# EAGLE schematic TeamB_PowerBoard (EAGLE 7.1.0)
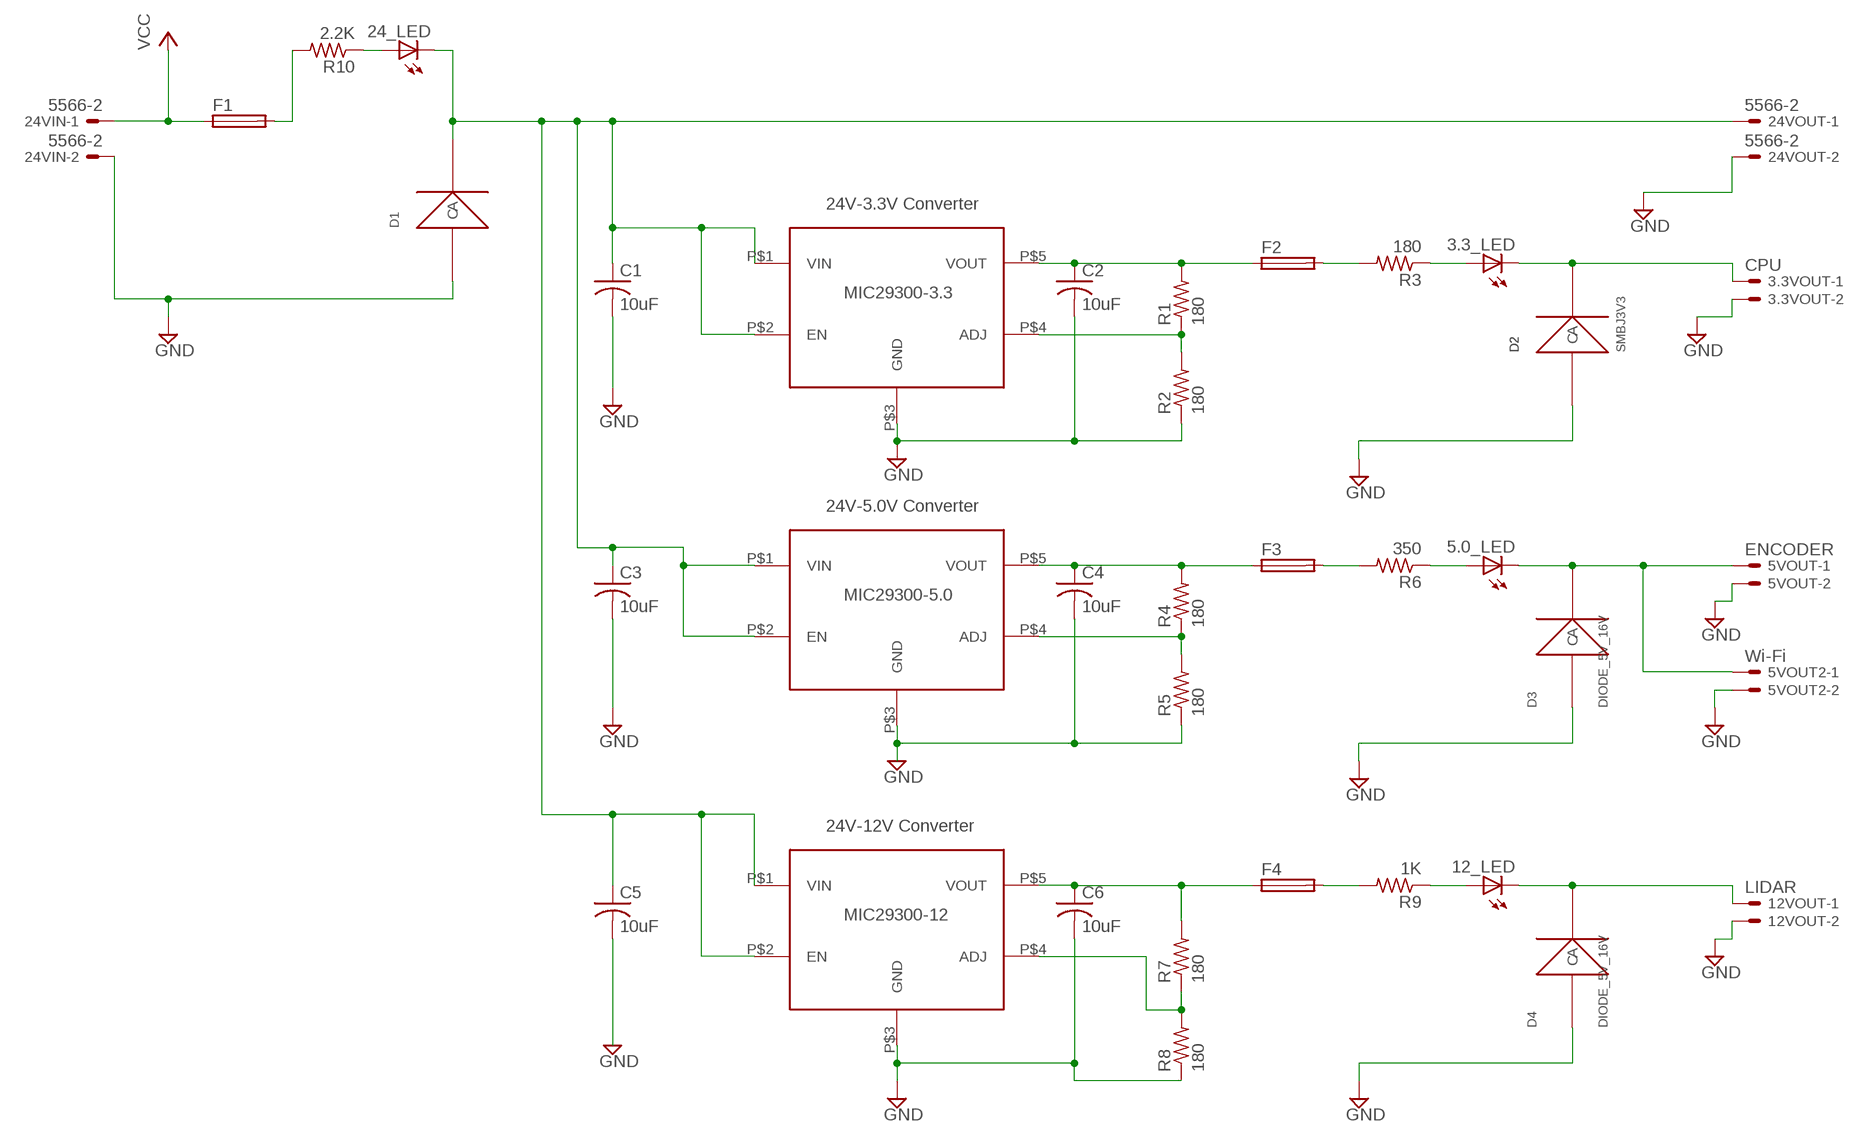
[diagram p0: schematic, sheet 1]

## Parts
3.3_LED  LEDSML1206  [SML1206]
3.3VOUT  CPU  C-GRID-02-70543  [70543-02]
5.0_LED  LEDSML1206  [SML1206]
5VOUT  ENCODER  C-GRID-02-70543  [70543-02]
5VOUT2  Wi-Fi  C-GRID-02-70543  [70543-02]
12_LED  LEDSML1206  [SML1206]
12VOUT  LIDAR  C-GRID-02-70543  [70543-02]
24_LED  LEDSML1206  [SML1206]
24VIN  5566-2  [5566-2]
24VOUT  5566-2  [5566-2]
C1  10uF  C-USC2220K  [C2220K]
C2  10uF  C-USC2220K  [C2220K]
C3  10uF  C-USC2220K  [C2220K]
C4  10uF  C-USC2220K  [C2220K]
C5  10uF  C-USC2220K  [C2220K]
C6  10uF  C-USC2220K  [C2220K]
D1  DIODE_26  [DIODE_26]
D2  SMBJ3V3  [SMBJ3V3]
D3  DIODE_5V_16V  [DIODE_5V_16V]
D4  DIODE_5V_16V  [DIODE_5V_16V]
F1  TE5  [TE5]
F2  TE5  [TE5]
F3  TE5  [TE5]
F4  TE5  [TE5]
R1  180  R-US_R1206  [R1206]
R2  180  R-US_R1206  [R1206]
R3  180  R-US_R1206  [R1206]
R4  180  R-US_R1206  [R1206]
R5  180  R-US_R1206  [R1206]
R6  350  R-US_R1206  [R1206]
R7  180  R-US_R1206  [R1206]
R8  180  R-US_R1206  [R1206]
R9  1K  R-US_R1206  [R1206]
R10  2.2K  R-US_R1206  [R1206]
U$1  MIC29300  [MIC29300W]
U$2  MIC29300  [MIC29300W]
U$3  MIC29300  [MIC29300W]

## Nets
GND: 3.3VOUT.2 5VOUT2.2 5VOUT.2 12VOUT.2 24VIN.2 24VOUT.2 C1.2 C2.2 C3.2 C6.2 D1.1(A) D2.1(A) D3.1(A) D4.1(A) R2.1 R8.1 U$1.P$3(GND) U$3.P$3(GND)
N$1: 24_LED.C 24VOUT.1 C1.1 C3.1 C5.1 D1.2(C) U$1.P$1(VIN) U$1.P$2(EN) U$2.P$1(VIN) U$2.P$2(EN) U$3.P$1(VIN) U$3.P$2(EN)
N$2: C5.2
N$3: F2.2 R3.2
N$4: 3.3_LED.A R3.1
N$5: C2.1 F2.1 R1.2 U$1.P$5(VOUT)
N$6: C4.2 R5.1 U$2.P$3(GND)
N$7: C4.1 F3.1 R4.2 U$2.P$5(VOUT)
N$8: C6.1 F4.1 R7.2 U$3.P$5(VOUT)
N$9: 3.3_LED.C 3.3VOUT.1 D2.2(C)
N$10: F1.2 R10.2
N$11: F3.2 R6.2
N$12: R1.1 R2.2 U$1.P$4(ADJ)
N$13: R4.1 R5.2 U$2.P$4(ADJ)
N$14: 5.0_LED.A R6.1
N$15: 5.0_LED.C 5VOUT2.1 5VOUT.1 D3.2(C)
N$16: F4.2 R9.2
N$17: 12_LED.A R9.1
N$18: 12_LED.C 12VOUT.1 D4.2(C)
N$19: R7.1 R8.2 U$3.P$4(ADJ)
N$20: 24_LED.A R10.1
VCC: 24VIN.1 F1.1

## Library data of the parts
3.3_LED 5.0_LED 12_LED 24_LED = led:LED: LED OSRAM: - CHIPLED LG R971, LG N971, LY N971, LG Q971, LY Q971, LO R971, LY R971 LH N974, LH R974 LS Q976, LO Q976, LY Q976 LO Q996 - Hyper CHIPLED LW Q18S LB Q993, LB Q99A, LB R99A - SideLED LS A670, LO A670, LY A670, LG A670, LP A670 LB A673, LV A673, LT A673, LW A673 LH A674 LY A675 LS A676, LA A676, LO A676, LY A676, LW A676 LS A679, LY A679, LG A679 - Hyper Micro SIDELED® LS Y876, LA Y876, LO Y876, LY Y876 LT Y87S - SmartLED LW L88C, LW L88S LB L89C, LB L89S, LG L890 LS L89K, LO L89K, LY L89K LS L896, LA L896, LO L896, LY L896 - TOPLED LS T670, LO T670, LY T670, LG T670, LP T670 LSG T670, LSP T670, LSY T670, LOP T670, LYG T670 LG T671, LOG T671, LSG T671 LB T673, LV T673, LT T673, LW T673 LH T674 LS T676, LA T676, LO T676, LY T676, LB T676, LH T676, LSB T676, LW T676 LB T67C, LV T67C, LT T67C, LS T67K, LO T67K, LY T67K, LW E67C LS E67B, LA E67B, LO E67B, LY E67B, LB E67C, LV E67C, LT E67C LW T67C LS T679, LY T679, LG T679 LS T770, LO T770, LY T770, LG T770, LP T770 LB T773, LV T773, LT T773, LW T773 LH T774 LS E675, LA E675, LY E675, LS T675 LS T776, LA T776, LO T776, LY T776, LB T776 LHGB T686 LT T68C, LB T68C - Hyper Mini TOPLED® LB M676 - Mini TOPLED Santana® LG M470 LS M47K, LO M47K, LY M47K Source: http://www.osram.convergy.de LUXEON: - LUMILED® LXK2-PW12-R00, LXK2-PW12-S00, LXK2-PW14-U00, LXK2-PW14-V00 LXK2-PM12-R00, LXK2-PM12-S00, LXK2-PM14-U00 LXK2-PE12-Q00, LXK2-PE12-R00, LXK2-PE12-S00, LXK2-PE14-T00, LXK2-PE14-U00 LXK2-PB12-K00, LXK2-PB12-L00, LXK2-PB12-M00, LXK2-PB14-N00, LXK2-PB14-P00, LXK2-PB14-Q00 LXK2-PR12-L00, LXK2-PR12-M00, LXK2-PR14-Q00, LXK2-PR14-R00 LXK2-PD12-Q00, LXK2-PD12-R00, LXK2-PD12-S00 LXK2-PH12-R00, LXK2-PH12-S00 LXK2-PL12-P00, LXK2-PL12-Q00, LXK2-PL12-R00 Source: www.luxeon.com KINGBRIGHT: KA-3528ASYC Source: www.kingbright.com
3.3VOUT 5VOUT 5VOUT2 12VOUT = con-molex:C-GRID-02: CONNECTOR wire to board 2.54 mm (0.100") pitch header; OC_FARNELL: unknown; OC_NEWARK: unknown
24VIN 24VOUT = con-molex:5566-2: Mini FIT connector 2 pol Source: http://www.molex.com; OC_FARNELL: 1822072; OC_NEWARK: unknown
C1-C6 = resistor:C-US: CAPACITOR, American symbol
D1 = TVS_Diode:DIODE_26
D2 = TVS_Diode:SMBJ3V3
D3 D4 = TVS_Diode:DIODE_5V_16V
F1-F4 = fuse:TE5: FUSE Wickmann; OC_FARNELL: unknown; OC_NEWARK: unknown
R1-R10 = rcl:R-US_: RESISTOR, American symbol
U$1 = MIC2930033WU:MIC29300: 5-Pin 3.3V MIC29300 are high current, high accuracy, low-dropout voltage regulator.
U$2 = MIC2930050WU:MIC29300: 5-Pin 5.0V MIC29300 are high current, high accuracy, low-dropout voltage regulator.
U$3 = MIC2930012WU:MIC29300: 5-Pin 12V MIC29300 are high current, high accuracy, low-dropout voltage regulator.